# Altium schematic sheet MuxVM.SchDoc: Power Outputs Voltage Source Selector
size 292 x 193 mm; CheckedBy: Łukasz Gójski; Author: Jakub Howors; CompanyName: Politechnika Warszawska; Organization: EITI; Address1: Nowowiejska 15/19; Address2: 00-665 Warszawa; SheetNumber: 12; SheetTotal: 13; HTTPLink: www.pw.edu.pl
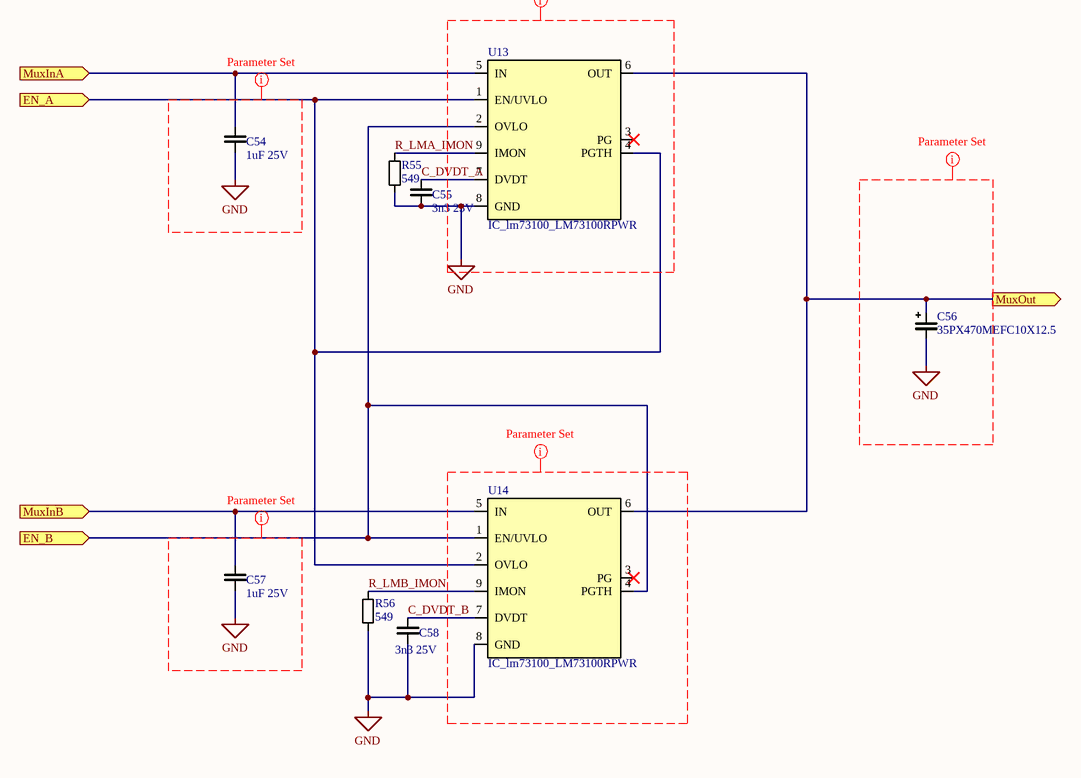
[diagram p0: MuxVM.SchDoc]

## Parts
C54  1uF 25V  [C_0603]
C55  3n3 25V  [C_0603]
C56  35PX470MEFC10X12.5  [CAP_PKPZ_10X12P5_LOW_RUB]
C57  1uF 25V  [C_0603]
C58  3n3 25V  [C_0603]
R55  549  [R_0603]
R56  549  [R_0603]
U13  IC_lm73100_LM73100RPWR  [LM73100_RPW0010A]
U14  IC_lm73100_LM73100RPWR  [LM73100_RPW0010A]

## Ports
EN_A (in, see PowerOutputsAssembly[1C]), EN_B (in, see PowerOutputsAssembly[1C]), MuxInA (in, see PowerOutputsAssembly[1B]), MuxInB (in, see PowerOutputsAssembly[1C]), MuxOut (out, see PowerOutputsAssembly[2B])

## Nets
GND: C54.1 C55.1 C56.2 C57.1 C58.1 R55.2 R56.2 U13.8(GND) U14.8(GND)
C_DVDT_A: C55.2 U13.7(DVDT)
C_DVDT_B: C58.2 U14.7(DVDT)
EN_A: U13.1(EN/UVLO) U13.4(PGTH) U14.2(OVLO) ; port EN_A
EN_B: U13.2(OVLO) U14.1(EN/UVLO) U14.4(PGTH) ; port EN_B
MuxInA: C54.2 U13.5(IN) ; port MuxInA
MuxInB: C57.2 U14.5(IN) ; port MuxInB
MuxOut: C56.1 U13.6(OUT) U14.6(OUT) ; port MuxOut
R_LMA_IMON: R55.1 U13.9(IMON)
R_LMB_IMON: R56.1 U14.9(IMON)

Not connected (* = marked no-connect by the designer): U13 3(PG)* 10(DNC); U14 3(PG)* 10(DNC)

## Layout directives
CompClassName: NoRelief: (no net found under the mark), EN_A, EN_B, GND
CompClassName: ThickRelief: GND

## Notes on the sheet
- Data:
- Tytuł:
- Rev.:
- Rozm.:
- A4
- Strona:
- z
- PBL4
- Opracował:
- Sprawdził:

## Library data of the parts
C54 C57 = C_1uF_25V: Ceramic capacitor; Value: 1u; Casing: 0603; Dielectric: XR7; Tolerance: 10%; Voltage: 25V; Technology: Ceramic
C55 C58 = C_3n3F_25V: Ceramic capacitor; Casing: 0603; Dielectric: XR7; Tolerance: 10%; Value: 3n3; Voltage: 25V; Technology: Ceramic
C56 = C_Pol_470uF_35V: 470 µF 35 V Aluminum Electrolytic Capacitors Radial, Can 2000 Hrs @ 105°C; Manufacturer: Rubycon; Value: 470u; Voltage: 35V; Tolerance: 20%
R55 R56 = R_549: Tolerance: 1%; Power: 100mW; Casing: 0603; Value: 549
U13 U14 = IC_lm73100_LM73100RPWR: Ideal diode ORing controller 5.5A 23V; Manufacturer: Texas Instruments